# Altium schematic sheet LTC6362_Schematic.SchDoc
size A; SheetNumber: 2; SheetTotal: 3
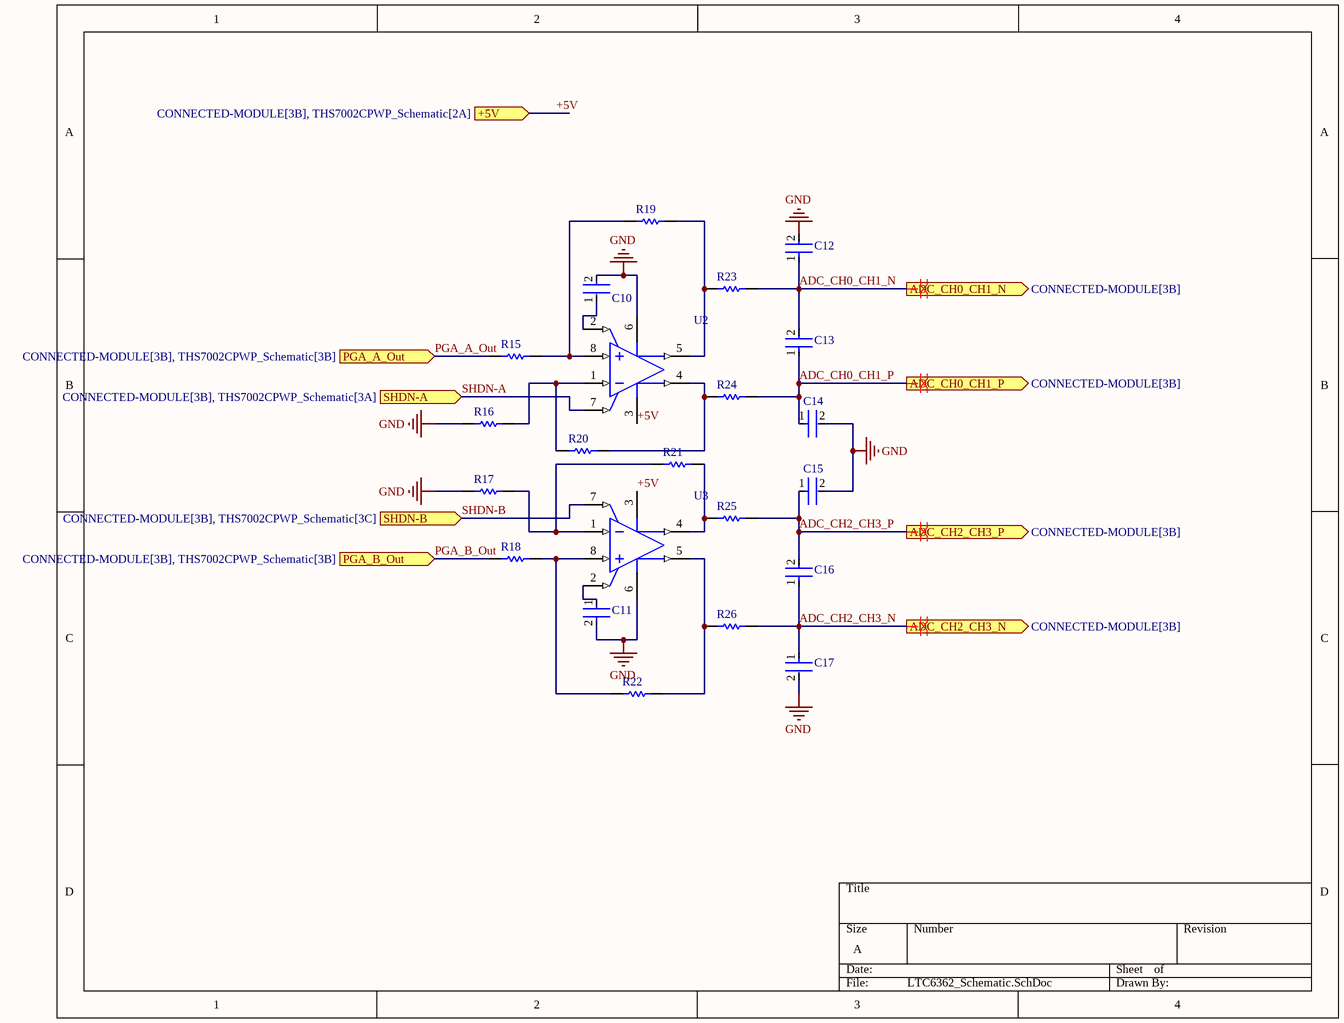
[diagram p0: LTC6362_Schematic.SchDoc]

## Parts
C10  GRM155R71C104KA88D  [FP-GRM15-MFG]  (value not drawn)
C11  GRM155R71C104KA88D  [FP-GRM15-MFG]  (value not drawn)
C12  C0402C392K3RACTU  [FP-C0402-BB-MFG]  (value not drawn)
C13  C0402C392K3RACTU  [FP-C0402-BB-MFG]  (value not drawn)
C14  C0402C392K3RACTU  [FP-C0402-BB-MFG]  (value not drawn)
C15  C0402C392K3RACTU  [FP-C0402-BB-MFG]  (value not drawn)
C16  C0402C392K3RACTU  [FP-C0402-BB-MFG]  (value not drawn)
C17  C0402C392K3RACTU  [FP-C0402-BB-MFG]  (value not drawn)
R15  ERJ-2RKF1241X  [RESC1005X40X25ML05T05]  (value not drawn)
R16  ERJ-2RKF1241X  [RESC1005X40X25ML05T05]  (value not drawn)
R17  ERJ-2RKF1241X  [RESC1005X40X25ML05T05]  (value not drawn)
R18  ERJ-2RKF1241X  [RESC1005X40X25ML05T05]  (value not drawn)
R19  ERJ-2RKF1001X  [RESC1005X40X25NL05T05]  (value not drawn)
R20  ERJ-2RKF1001X  [RESC1005X40X25NL05T05]  (value not drawn)
R21  ERJ-2RKF1001X  [RESC1005X40X25NL05T05]  (value not drawn)
R22  ERJ-2RKF1001X  [RESC1005X40X25NL05T05]  (value not drawn)
R23  RC0402FR-0735R7L  [RESC1005X40X25ML05T10]  (value not drawn)
R24  RC0402FR-0735R7L  [RESC1005X40X25ML05T10]  (value not drawn)
R25  RC0402FR-0735R7L  [RESC1005X40X25ML05T10]  (value not drawn)
R26  RC0402FR-0735R7L  [RESC1005X40X25ML05T10]  (value not drawn)
U2  LTC6362HMS8#PBF  [LT-MS8-8_L]  (value not drawn)
U3  LTC6362HMS8#PBF  [LT-MS8-8_L]  (value not drawn)

## Ports
+5V (in, see CONNECTED-MODULE[3B], THS7002CPWP_Schematic[2A]), ADC_CH0_CH1_N (out, see CONNECTED-MODULE[3B]), ADC_CH0_CH1_P (out, see CONNECTED-MODULE[3B]), ADC_CH2_CH3_N (out, see CONNECTED-MODULE[3B]), ADC_CH2_CH3_P (out, see CONNECTED-MODULE[3B]), PGA_A_Out (in, see CONNECTED-MODULE[3B], THS7002CPWP_Schematic[3B]), PGA_B_Out (in, see CONNECTED-MODULE[3B], THS7002CPWP_Schematic[3B]), SHDN-A (in, see CONNECTED-MODULE[3B], THS7002CPWP_Schematic[3A]), SHDN-B (in, see CONNECTED-MODULE[3B], THS7002CPWP_Schematic[3C])

## Nets
GND: C10.2 C11.2 C12.2 C14.2 C15.2 C17.2 R16.1 R17.1 U2.6(V-) U3.6(V-)
+5V: U2.3(V+) U3.3(V+) ; port +5V
ADC_CH0_CH1_N: C12.1 C13.2 R23.2 ; port ADC_CH0_CH1_N
ADC_CH0_CH1_P: C13.1 C14.1 R24.2 ; port ADC_CH0_CH1_P
ADC_CH2_CH3_N: C16.1 C17.1 R26.2 ; port ADC_CH2_CH3_N
ADC_CH2_CH3_P: C15.1 C16.2 R25.2 ; port ADC_CH2_CH3_P
PGA_A_Out: R15.1 ; port PGA_A_Out
PGA_B_Out: R18.1 ; port PGA_B_Out
SHDN-A: U2.7(~{SHDN}) ; port SHDN-A
SHDN-B: U3.7(~{SHDN}) ; port SHDN-B
NetC10_1: C10.1 U2.2(VOCM)
NetC11_1: C11.1 U3.2(VOCM)
NetR15_2: R15.2 R19.1 U2.8(+IN)
NetR16_2: R16.2 R20.1 U2.1(-IN)
NetR17_2: R17.2 R21.1 U3.1(-IN)
NetR18_2: R18.2 R22.1 U3.8(+IN)
NetR19_2: R19.2 R23.1 U2.5(-OUT)
NetR20_2: R20.2 R24.1 U2.4(+OUT)
NetR21_2: R21.2 R25.1 U3.4(+OUT)
NetR22_2: R22.2 R26.1 U3.5(-OUT)

## Layout directives
differential pair: ADC_CH0_CH1_N, ADC_CH0_CH1_P, ADC_CH2_CH3_N, ADC_CH2_CH3_P

## Library data of the parts
C10 C11 = CMP-2100-03641-2: CAP CER 0.1UF 16V X7R 0402; Manufacturer: Murata; Standoff Height: 0mm; Tolerance: 10%; Voltage Rating: 16Vdc; Material: Ceramic; Capacitance: 0.10μF; Value: 0.10μF; RoHS: TRUE; Manufacturer Part Number: GRM155R71C104KA88D; Temperature Characteristic: X7R; Octopart: https://octopart.com/grm155r71c104ka88d-murata-196880; Digikey Description: CAP CER 0.1UF 16V X7R 0402; Device Class L3: Ceramic Capacitors; Height: 0.55mm; ComponentLink2Description: Datasheet; Temperature Range Low: -55°C; Ipc Land Pattern Name: CAPC10050X219; ComponentLink2URL: https://search.murata.co.jp/Ceramy/image/img/A01X/G101/ENG/GRM155R71H471KA01-01A.pdf; Device Class L1: Passive Components; Lead Free: yes; Category: Cap; Package: GRM15; Temperature: -55°C to +125°C; Device Class L2: Capacitors; Temperature Range High: +125°C; Mouser Description: 0402 0.1 uF 16V ±10 % Tolerance X7R SMT Multilayer Ceramic Capacitor
C12-C17 = CMP-2008-03191-2: CAP CER 3900PF 25V X7R 0402; Manufacturer: Kemet; Value: 3,900 pF; Material: Ceramic; Temperature Coefficient: 15%; Tolerance: 0.1; Temperature Characteristic: X7R; Height: 0.55mm; Temperature: -55°C to +125°C; Temperature Range High: +125°C; Automotive: No; RoHS: TRUE; Manufacturer Part Number: C0402C392K3RACTU; Mouser Description: Capacitor; Ceramic; Cap 3900pF; Tol 10%; SMT; Vol-Rtg 50V; X7R; ComponentLink2URL: https://content.kemet.com/datasheets/KEM_C1002_X7R_SMD.pdf; Octopart: https://octopart.com/c0402c392k3ractu-kemet-141288; Category: Cap; Lead Free: Yes; Device Class L1: Passive Components; Package: C0402-BB; ComponentLink2Description: Datasheet; Digikey Description: CAP CER 3900PF 25V X7R 0402; Voltage Rating: 25 V; Capacitance: 3,900 pF; Ipc Land Pattern Name: CAPC10050X50; Temperature Range Low: -55°C; Device Class L2: Capacitors; Device Class L3: Ceramic Capacitors
R15-R18 = CMP-2002-00652-1: Manufacturer: Panasonic; Part Number: ERJ-2RKF1241X
R19-R22 = CMP-1011-00510-4: Chip Resistor, 1 KOhm, +/- 1%, 100 mW, -55 to 155 degC, 0402 (1005 Metric), RoHS, Tape and Reel; Manufacturer: Basic Passives; Voltage Rating: 50 V; Case\/Package: 0402; Resistance: 1 KOhm; Power Rating: 100 mW; PartNumber: ERJ-2RKF1001X; DatasheetVersion: 04/2015; Radiation Hardening: No; Pins: 2; Height: 0.35 mm; RoHSCompliant: true; Case Code (Imperial): 0402; ComponentLink2Description: Datasheet; ComponentLink1Description: Manufacturer URL; PackageReference: 0402; Mount: Surface Mount; Package Quantity: 10000; Tolerance: 1%; ComponentLink1URL: http://www.panasonic.com/; PackageDescription: 2-Pin Surface Mount Device, Body 1 x 0.5 mm; Mounting Technology: Surface Mount; Case Code (Metric): 1005; ComponentLink2URL: http://industrial.panasonic.com/cdbs/www-data/pdf/RDA0000/AOA0000C86.pdf; REACH SVHC: Yes; Packaging: Tape and Reel; Max Operating Temperature: 155 degC; Min Operating Temperature: -55 degC; Width: 0.5 mm; Length: 1 mm
R23-R26 = CMP-2002-07630-1: Manufacturer: Yageo; Part Number: RC0402FR-0735R7L
U2 U3 = CMP-0359-00920-2: Single Channel, Precision, Low Power Differential Operational Amplifier / SAR ADC Driver, RRIO, 180 MHz Typical GBW, 45 V/us Typical SR, 2.8 to 5.25 V, 8-Pin SOP (MS8-8), High Temperature / Automotive, Pb-Free; Manufacturer: Linear Technology; Vs Max (V): 5.25; Is (mA) Typical: 0.9; SR (V/us) Typical: 45; Channels (#): 1; GBW (MHz) Typical: 180; Vos (mV) Typical: 0.05; Vs Min (V): 2.8; PartNumber: LTC6362HMS8#PBF; PackageDescription: 8-Lead Plastic Small Outline, Body 3.9 x 4.9 mm, Pitch 1.27 mm; ComponentLink2Description: Datasheet; ComponentLink3URL: http://cds.linear.com/docs/en/packaging/05081610_G_SO8.pdf; ComponentLink1Description: Manufacturer URL; PackageReference: LT-MS8-8; ComponentLink2URL: http://cds.linear.com/docs/en/datasheet/6362fa.pdf; PackageVersion: Rev G; Mounting Technology: Surface Mount; Linear Technology Part Number: LTC6362; DatasheetVersion: Rev. A; RevisionNote: URLs updated; RoHS: Pb-Free; ComponentLink1URL: http://www.linear.com/; Type: DIFF; ComponentLink3Description: Package Specification